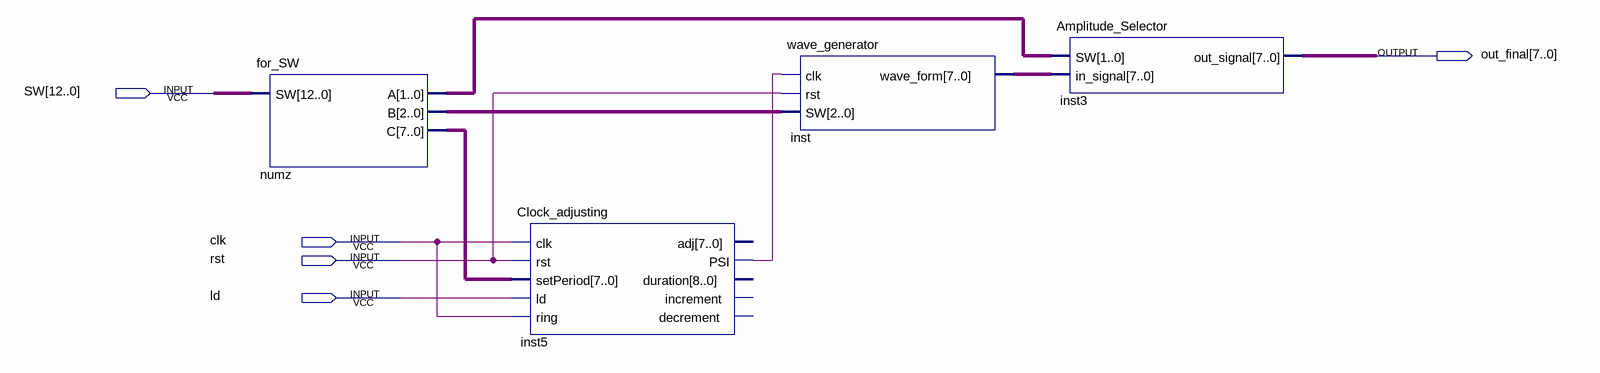
[diagram p0: schematic sheet]
// Quartus schematic Lab_3_project.bdf as structural Verilog: 4 symbols, 5 pins
module Lab_3_project (
  input  [12:0] SW,
  input  clk,
  input  rst,
  input  ld,
  output [7:0] out_final
);

  wire inst5_psi;
  wire [1:0] numz_a;
  wire [2:0] numz_b;
  wire [7:0] inst_wave_form, numz_c;

  for_SW numz (.SW(SW), .A(numz_a), .B(numz_b), .C(numz_c));
  Clock_adjusting inst5 (
    .clk(clk), .rst(rst), .setPeriod(numz_c), .ld(ld), .ring(clk), .PSI(inst5_psi));  // open: adj, duration, increment, decrement
  wave_generator inst (.clk(inst5_psi), .rst(rst), .SW(numz_b), .wave_form(inst_wave_form));
  Amplitude_Selector inst3 (.SW(numz_a), .in_signal(inst_wave_form), .out_signal(out_final));
endmodule
